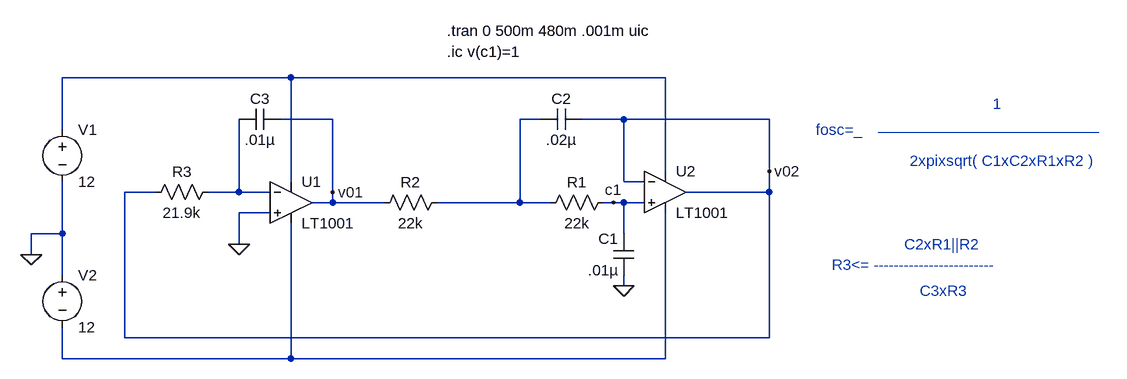
[diagram p0: schematic cuadratura3.asc]
cuadratura3.asc, the LTspice schematic file:
Version 4
SHEET 1 1560 680
WIRE 256 -16 -96 -16
WIRE 832 -16 256 -16
WIRE 320 48 240 48
WIRE 640 48 608 48
WIRE 768 48 704 48
WIRE 992 48 768 48
WIRE -96 64 -96 -16
WIRE 832 128 832 -16
WIRE 992 128 992 48
WIRE 256 144 256 -16
WIRE 768 144 768 48
WIRE 800 144 768 144
WIRE 48 160 0 160
WIRE 176 160 176 48
WIRE 176 160 128 160
WIRE 224 160 176 160
WIRE 320 160 320 48
WIRE 992 160 992 128
WIRE 992 160 864 160
WIRE 320 176 320 160
WIRE 320 176 288 176
WIRE 400 176 320 176
WIRE 608 176 608 48
WIRE 608 176 480 176
WIRE 656 176 608 176
WIRE 752 176 736 176
WIRE 768 176 752 176
WIRE 800 176 768 176
WIRE 224 192 176 192
WIRE -96 224 -96 144
WIRE -96 224 -144 224
WIRE 768 224 768 176
WIRE 176 240 176 192
WIRE -144 256 -144 224
WIRE -96 288 -96 224
WIRE 768 304 768 288
WIRE 0 384 0 160
WIRE 992 384 992 160
WIRE 992 384 0 384
WIRE -96 416 -96 368
WIRE 256 416 256 208
WIRE 256 416 -96 416
WIRE 832 416 832 192
WIRE 832 416 256 416
FLAG -144 256 0
FLAG 176 240 0
FLAG 320 160 v01
FLAG 992 128 v02
FLAG 768 304 0
FLAG 752 176 c1
SYMBOL Opamps\\LT1001 256 112 R0
SYMATTR InstName U1
SYMBOL Opamps\\LT1001 832 96 R0
SYMATTR InstName U2
SYMBOL cap 240 32 R90
WINDOW 0 0 32 VBottom 2
WINDOW 3 32 32 VTop 2
SYMATTR InstName C3
SYMATTR Value .01µ
SYMBOL voltage -96 48 R0
WINDOW 123 0 0 Left 0
WINDOW 39 0 0 Left 0
SYMATTR InstName V1
SYMATTR Value 12
SYMBOL voltage -96 272 R0
WINDOW 123 0 0 Left 0
WINDOW 39 0 0 Left 0
SYMATTR InstName V2
SYMATTR Value 12
SYMBOL res 144 144 R90
WINDOW 0 0 56 VBottom 2
WINDOW 3 32 56 VTop 2
SYMATTR InstName R3
SYMATTR Value 21.9k
SYMBOL cap 704 32 R90
WINDOW 0 0 32 VBottom 2
WINDOW 3 32 32 VTop 2
SYMATTR InstName C2
SYMATTR Value .02µ
SYMBOL cap 784 288 R180
WINDOW 0 24 56 Left 2
WINDOW 3 24 8 Left 2
SYMATTR InstName C1
SYMATTR Value .01µ
SYMBOL res 752 160 R90
WINDOW 0 0 56 VBottom 2
WINDOW 3 32 56 VTop 2
SYMATTR InstName R1
SYMATTR Value 22k
SYMBOL res 496 160 R90
WINDOW 0 0 56 VBottom 2
WINDOW 3 32 56 VTop 2
SYMATTR InstName R2
SYMATTR Value 22k
TEXT 496 -56 Left 2 !.ic v(c1)=1
TEXT 496 -88 Left 2 !.tran 0 500m 480m .001m uic
TEXT 1064 64 Left 2 ;fosc=_
TEXT 1160 56 Left 2 ;__________________________
TEXT 1208 112 Left 2 ;2xpixsqrt( C1xC2xR1xR2 )
TEXT 1336 24 Left 2 ;1
TEXT 1088 272 Left 2 ;R3<= ------------------------
TEXT 1200 240 Left 2 ;C2xR1||R2
TEXT 1224 312 Left 2 ;C3xR3

The netlist it stands for:
* cuadratura3.asc
XU1 0 N003 N001 N004 v01 LT1001  ; pins In+ In- V+ V- OUT
XU2 c1 v02 N001 N004 v02 LT1001  ; pins In+ In- V+ V- OUT
C3 v01 N003 .01µ
V1 N001 0 12
V2 0 N004 12
R3 N003 v02 21.9k
C2 v02 N002 .02µ
C1 0 c1 .01µ
R1 c1 N002 22k
R2 N002 v01 22k
.ic v(c1)=1
.tran 0 500m 480m .001m uic
* fosc=_
* __________________________
* 2xpixsqrt( C1xC2xR1xR2 )
* 1
* R3<= ------------------------
* C2xR1||R2
* C3xR3
.lib LTC.lib
.backanno
.end